# EAGLE design TSOC_USBUART2_R4_0 (EAGLE 6.6.0)
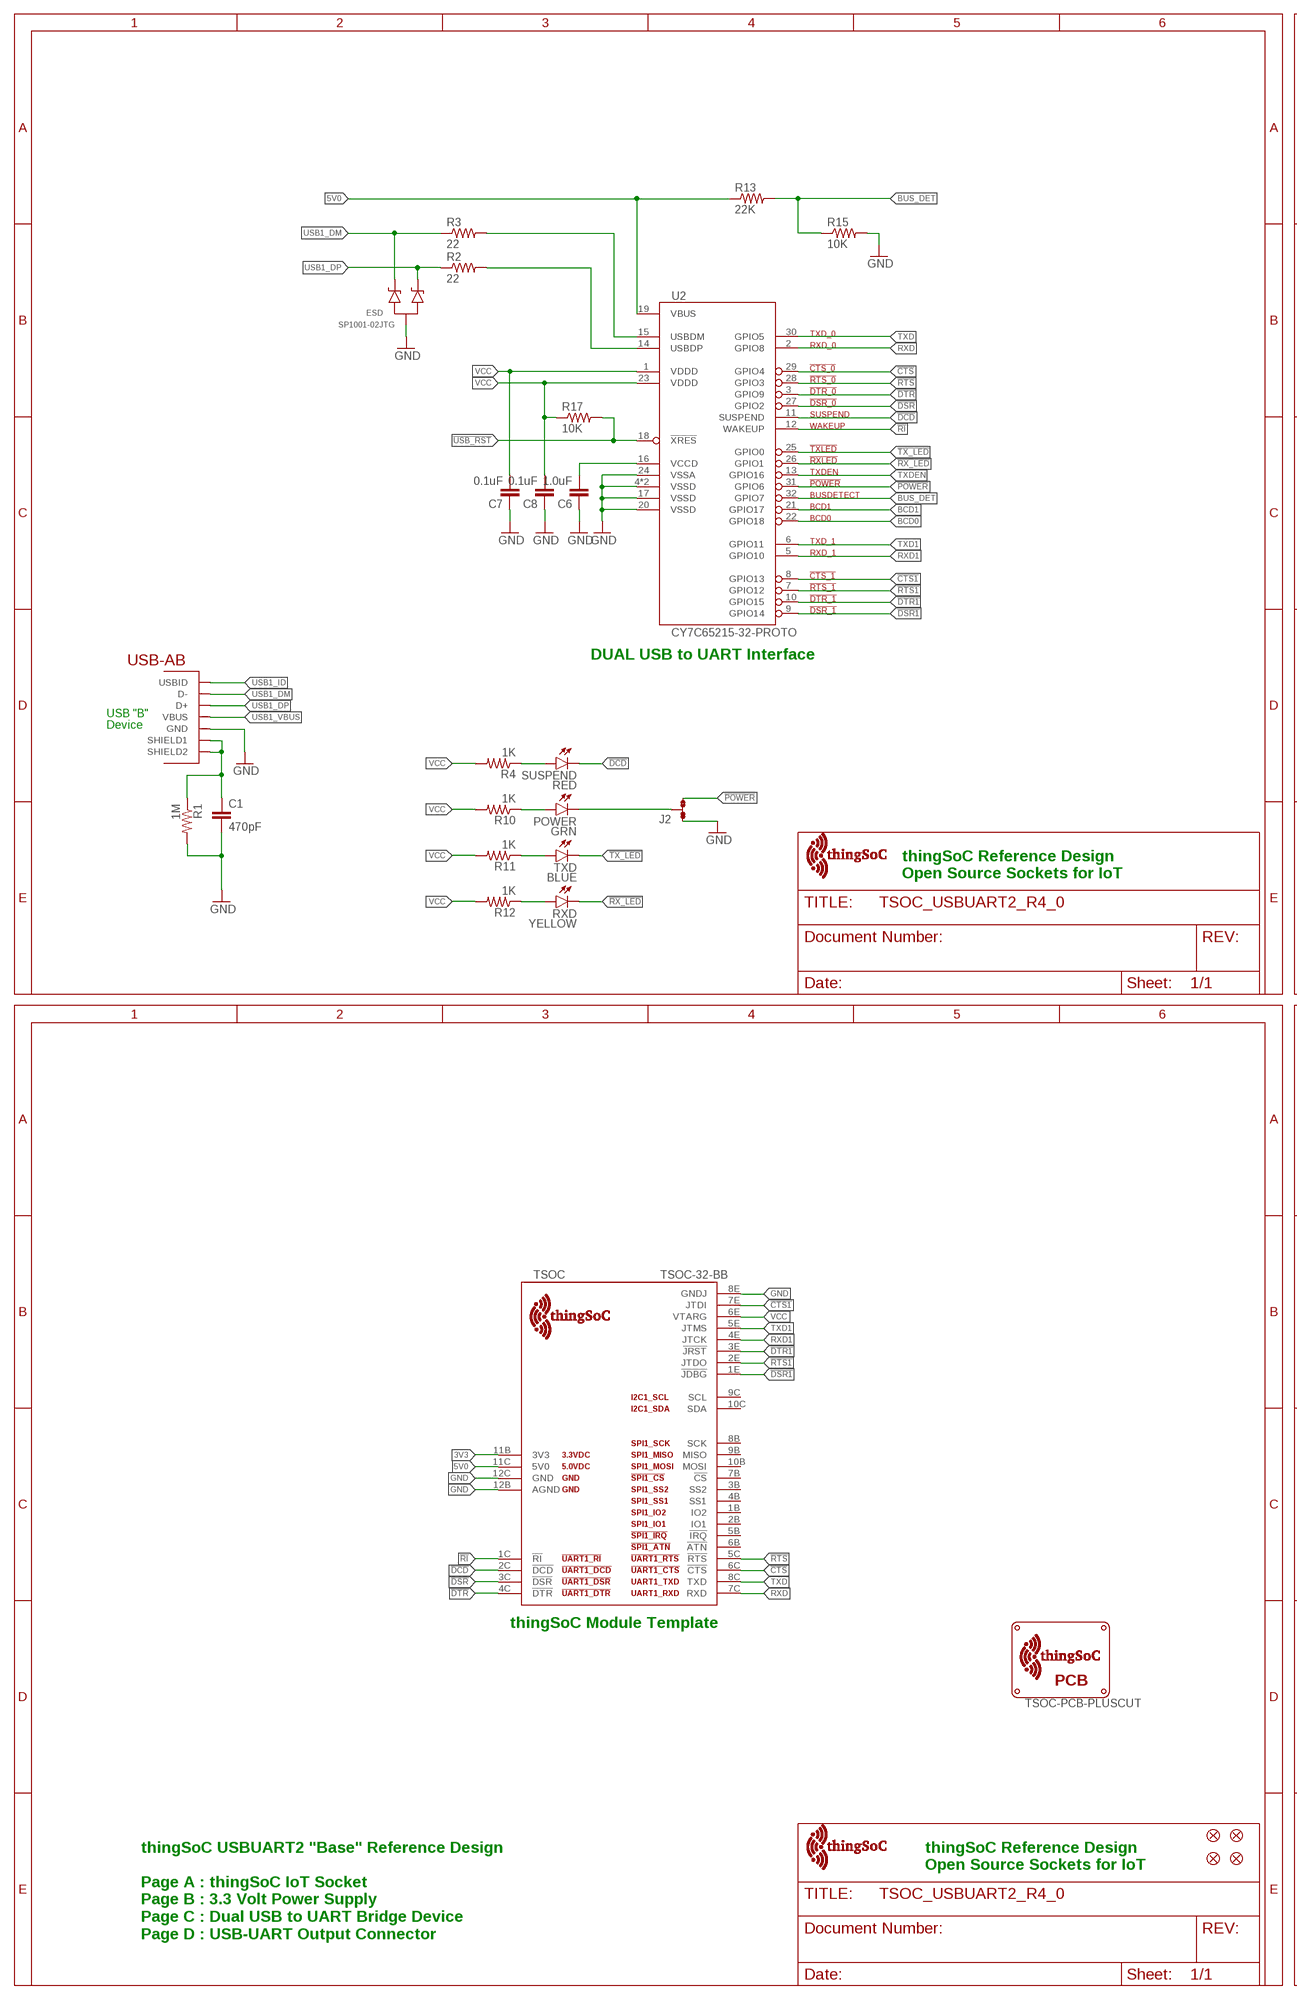
[diagram p0: schematic, sheet 1, part 1 of 2]
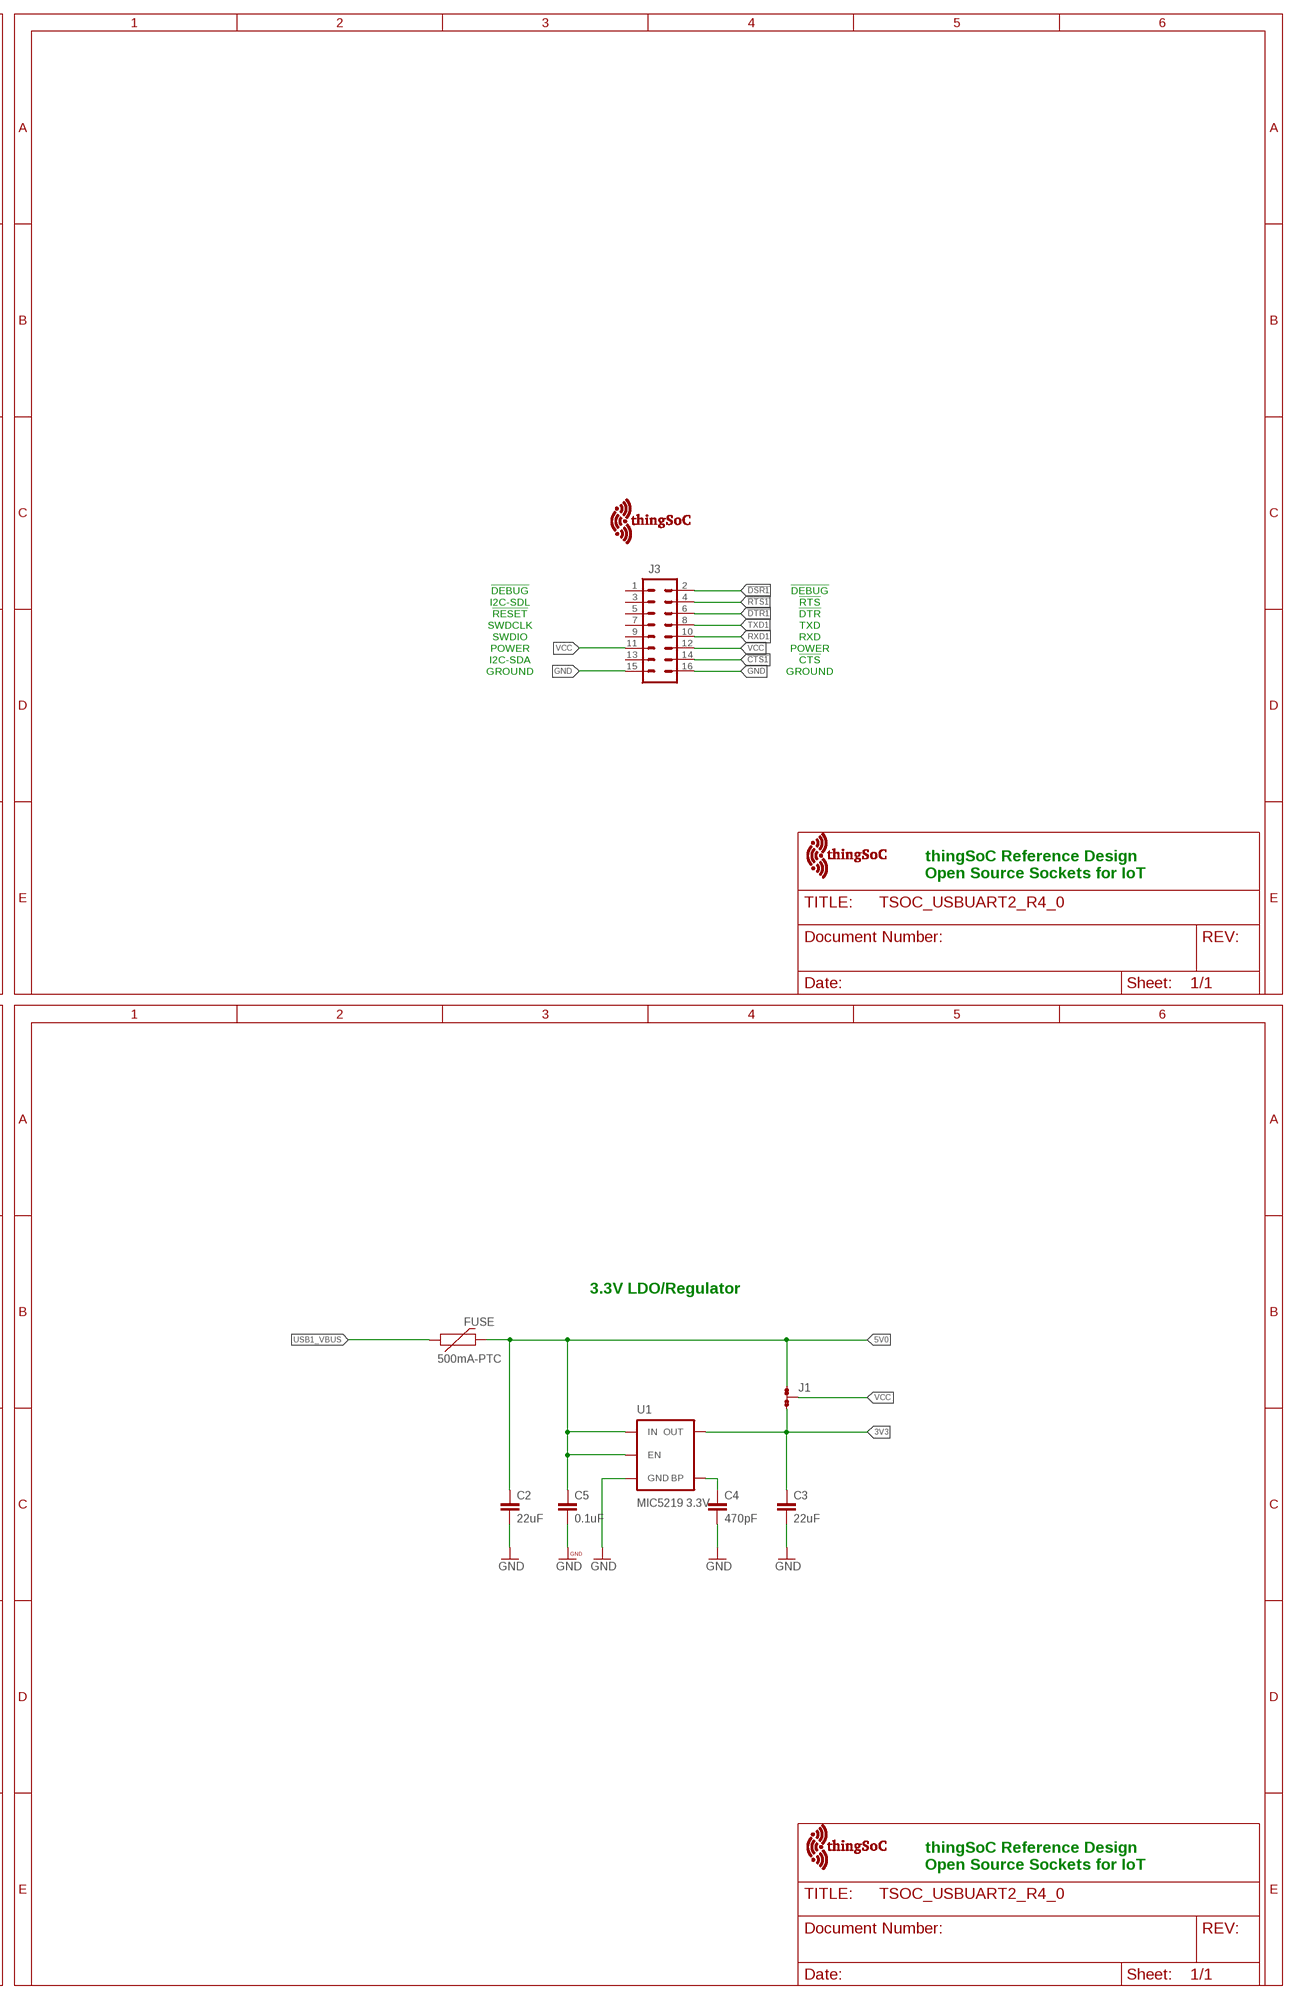
[diagram p1: schematic, sheet 1, part 2 of 2]

## Parts
C1  470pF  CAP-0603  [EIA-0603]
C2  22uF  CAP-1206  [EIA-1206]
C3  22uF  CAP-1206  [EIA-1206]
C4  470pF  CAP-0603  [EIA-0603]
C5  0.1uF  CAP-0603  [EIA-0603]
C6  1.0uF  CAP-0603  [EIA-0603]
C7  0.1uF  CAP-0603  [EIA-0603]
C8  0.1uF  CAP-0603  [EIA-0603]
ESD  SP1001-02JTG  [SC70-3]
FID1  FIDUCIALUFIDUCIAL  [MICRO-FIDUCIAL]
FID2  FIDUCIALUFIDUCIAL  [MICRO-FIDUCIAL]
FID3  FIDUCIALUFIDUCIAL  [MICRO-FIDUCIAL]
FID4  FIDUCIALUFIDUCIAL  [MICRO-FIDUCIAL]
FUSE  500mA-PTC  PTCSMD  [PTC-1206]
J1  JMP-3-1_2  [JMP-3-1_2]
J2  JMP-3-1_2  [JMP-3-1_2]
J3  M08X2  [2X8]
POWER  GRN  LED0603  [LED-0603]
R1  1M  RESISTOR-0603  [EIA-0603]
R2  22  RESISTOR-0603  [EIA-0603]
R3  22  RESISTOR-0603  [EIA-0603]
R4  1K  RESISTOR-0603  [EIA-0603]
R10  1K  RESISTOR-0603  [EIA-0603]
R11  1K  RESISTOR-0603  [EIA-0603]
R12  1K  RESISTOR-0603  [EIA-0603]
R13  22K  RESISTOR-0603  [EIA-0603]
R15  10K  RESISTOR-0603  [EIA-0603]
R17  10K  RESISTOR-0603  [EIA-0603]
RXD  YELLOW  LED0603  [LED-0603]
SUSPEND  RED  LED0603  [LED-0603]
TSOC  TSOC-32-BB  [TSOC-BB-S32]
TXD  BLUE  LED0603  [LED-0603]
U1  MIC5219 3.3V  V_REG_MIC52193.3V  [SOT23-5]
U2  CY7C65215-32-PROTO  [QFN32-PROTO]
U$3  TSOC-LOGO-LRG  [TSOC-LOGO-LRG]
U$4  TSOC-LOGO  [TSOC-LOGO-BLANK]
U$5  TSOC-LOGO  [TSOC-LOGO-BLANK]
U$6  TSOC-LOGO  [TSOC-LOGO-BLANK]
U$7  TSOC-PCB-PLUSCUT  [TSOC-BB-BRD-PLUS-CUT]
U$8  TSOC-LOGO-SMALL  [TSOC-LOGO-SML]
USB  USB_AB  [USB-AB-MICRO-SMD]

## Nets
3V3: C3.1 J1.3 TSOC.11B(3V3) U1.5(OUT)
5V0: C2.1 C5.1 FUSE.2 J1.1 R13.1 TSOC.11C(5V0) U1.1(IN) U1.3(EN) U2.19(VBUS)
!CTS: TSOC.6C(!CTS) U2.29(GPIO4)
!CTS1: J3.14 TSOC.7E(JTDI) U2.8(GPIO13)
!DCD: SUSPEND.C TSOC.2C(!DCD) U2.11(SUSPEND)
!DSR: TSOC.3C(!DSR) U2.27(GPIO2)
!DSR1: J3.2 TSOC.1E(!JDBG) U2.9(GPIO14)
!DTR: TSOC.4C(!DTR) U2.3(GPIO9)
!DTR1: J3.6 TSOC.3E(!JRST) U2.10(GPIO15)
!POWER: J2.3 U2.31(GPIO6)
!RI: TSOC.1C(!RI) U2.12(WAKEUP)
!RTS: TSOC.5C(!RTS) U2.28(GPIO3)
!RTS1: J3.4 TSOC.2E(JTDO) U2.7(GPIO12)
!RX_LED: RXD.C U2.26(GPIO1)
!TX_LED: TXD.C U2.25(GPIO0)
!USB_RST: R17.2 U2.18(!XRES)
BCD0: U2.22(GPIO18)
BCD1: U2.21(GPIO17)
BLU: R11.1 TXD.A
BUS_DET: R13.2 R15.1 U2.32(GPIO7)
BYPASS1: C4.1 U1.4(BP)
GND [vcc]: C1.2 C2.2 C3.2 C4.2 C5.2 C6.1 C7.1 C8.1 ESD.3(A) J2.1 J3.15 J3.16 R1.2 R15.2 TSOC.8E(GNDJ) TSOC.12B(AGND) TSOC.12C(GND) U1.2(GND) U2.4(VSSD) U2.17(VSSD) U2.20(VSSD) U2.24(VSSA) U2.EXP(VSSD) USB.GND
GRN: POWER.A R10.1
PWR: J2.2 POWER.C
RED: R4.1 SUSPEND.A
RXD: TSOC.7C(RXD) U2.2(GPIO8)
RXD1: J3.10 TSOC.4E(JTCK) U2.5(GPIO10)
TXD: TSOC.8C(TXD) U2.30(GPIO5)
TXD1: J3.8 TSOC.5E(JTMS) U2.6(GPIO11)
TXDEN: U2.13(GPIO16)
USB1_DM: ESD.2(C2) R3.1 USB.D-
USB1_DP: ESD.1(C1) R2.1 USB.D+
USB1_ID: USB.ID(USBID)
USB1_M: R3.2 U2.15(USBDM)
USB1_P: R2.2 U2.14(USBDP)
USB1_SHIELD: C1.1 R1.1 USB.SHIELD1 USB.SHIELD2
USB1_VBUS: FUSE.1 USB.VBUS
VCC: C7.2 C8.2 J1.2 J3.11 J3.12 R4.2 R10.2 R11.2 R12.2 R17.1 TSOC.6E(VTARG) U2.1(VDDD) U2.23(VDDD)
VCCD1: C6.2 U2.16(VCCD)
YEL: R12.1 RXD.A
Unconnected: J3.1 J3.3 J3.5 J3.7 J3.9 J3.13 TSOC.1B(IO2) TSOC.2B(IO1) TSOC.3B(SS2) TSOC.4B(SS1) TSOC.5B(!IRQ) TSOC.6B(!ATN) TSOC.7B(!CS) TSOC.8B(SCK) TSOC.9B(MISO) TSOC.9C(SCL) TSOC.10B(MOSI) TSOC.10C(SDA)

## Notes on the sheet
- !DEBUG | !DEBUG
- I2C-SDL | !RTS
- !RESET | !DTR
- SWDCLK | TXD
- SWDIO | RXD
- POWER | POWER
- DUAL USB to UART Interface | I2C-SDA | !CTS
- GROUND | GROUND
- USB "B"
- Device
- thingSoC Reference Design
  Open Source Sockets for IoT
- thingSoC Reference Design
  Open Source Sockets for IoT
- 3.3V LDO/Regulator
- thingSoC Module Template
- thingSoC Reference Design
  Open Source Sockets for IoT
- thingSoC Reference Design
  Open Source Sockets for IoT
- thingSoC USBUART2 "Base" Reference Design
  
  Page A : thingSoC IoT Socket
  Page B : 3.3 Volt Power Supply
  Page C : Dual USB to UART Bridge Device
  Page D : USB-UART Output Connector

## Library data of the parts
C1-C8 = TSOC_USBUART2:CAP: Ceramic Capacitor SMD
ESD = TSOC-ESP8266-BASE:SP1001-02JTG: Littelfuse SP1001-02JTG TVS Diode Array 8pf 15kV Source: http://www.littelfuse.com/data/en/Product_Catalogs/Littelfuse_TVS_Diode_Array_SPA_Catalog.pdf patternshed.com: created 3/25/2012
FID1-FID4 = TSOC-ESP8266-BASE:FIDUCIAL: Fiducial Alignment Points Various fiducial points for machine vision alignment.
FUSE = SparkFun:PTC: Resettable Fuse PTC Resettable Fuse. Spark Fun Electronics SKU : COM-08357
J1 J2 = PatternAgents-ProtoPads:JMP-3-1_2: Three Terminal Jumper - 1 & 2 Connected Positions 1and 2 are normally connected. PatternAgents ProtoPads Library Schematic and PCB layout libraries for design patterns by PatternAgents. For the CADSoft Eagle CAD program : http://www.cadsoftusa.com/download-eagle/ Source LBR : http://www.patternagents.com Github : https://github.com/PatternAgents License : http://creativecommons.org/licenses/by-sa/4.0/ (Creative Commons 4.0) THIS SOFTWARE IS PROVIDED BY THE CONTRIBUTORS "AS IS" AND WITHOUT ANY EXPRESS OR IMPLIED WARRANTIES, INCLUDING, BUT NOT LIMITED TO, THE IMPLIED WARRANTIES OF MERCHANTABILITY AND FITNESS FOR A PARTICULAR PURPOSE ARE DISCLAIMED. IN NO EVENT SHALL THE COPYRIGHT OWNER OR CONTRIBUTORS BE LIABLE FOR ANY DIRECT, INDIRECT, INCIDENTAL, SPECIAL, EXEMPLARY, OR CONSEQUENTIAL DAMAGES (INCLUDING, BUT NOT LIMITED TO, PROCUREMENT OF SUBSTITUTE GOODS OR SERVICES; LOSS OF USE, DATA, OR PROFITS; OR BUSINESS INTERRUPTION) HOWEVER CAUSED AND ON ANY THEORY OF LIABILITY, WHETHER IN CONTRACT, STRICT LIABILITY, OR TORT (INCLUDING NEGLIGENCE OR OTHERWISE) ARISING IN ANY WAY OUT OF THE USE OF THIS SOFTWARE, EVEN IF ADVISED OF THE POSSIBILITY OF SUCH DAMAGE.; BOM: EXCLUDE
J3 = PatternAgents-ProtoPads:M08X2: .1" headers, two rows of 8 each
POWER RXD SUSPEND TXD = TSOC-ESP8266-BASE:LED: LEDs Standard schematic elements and footprints for 5mm, 3mm, 1206, and 0603 sized LEDs. 5mm - Spark Fun Electronics SKU : COM-00529 (and others)
R1-R4 R10-R13 R15 R17 = TSOC_USBUART2:RESISTOR
TSOC = thingSoC:TSOC-32: thingSoC Thirty-Two (32) Pin Socket Source LBR : http://www.thingsoc.com Github : https://github.com/thingsoc License : http://creativecommons.org/licenses/by-sa/4.0/ (Creative Commons 4.0) THIS SOFTWARE IS PROVIDED BY THE CONTRIBUTORS "AS IS" AND WITHOUT ANY EXPRESS OR IMPLIED WARRANTIES, INCLUDING, BUT NOT LIMITED TO, THE IMPLIED WARRANTIES OF MERCHANTABILITY AND FITNESS FOR A PARTICULAR PURPOSE ARE DISCLAIMED. IN NO EVENT SHALL THE COPYRIGHT OWNER OR CONTRIBUTORS BE LIABLE FOR ANY DIRECT, INDIRECT, INCIDENTAL, SPECIAL, EXEMPLARY, OR CONSEQUENTIAL DAMAGES (INCLUDING, BUT NOT LIMITED TO, PROCUREMENT OF SUBSTITUTE GOODS OR SERVICES; LOSS OF USE, DATA, OR PROFITS; OR BUSINESS INTERRUPTION) HOWEVER CAUSED AND ON ANY THEORY OF LIABILITY, WHETHER IN CONTRACT, STRICT LIABILITY, OR TORT (INCLUDING NEGLIGENCE OR OTHERWISE) ARISING IN ANY WAY OUT OF THE USE OF THIS SOFTWARE, EVEN IF ADVISED OF THE POSSIBILITY OF SUCH DAMAGE.
U1 = TSOC-ESP8266-BASE:V_REG_MIC5219: V_REG MIC5219 Standard 3.3V and 5V 500mA LDO voltage regulator in SOT-23 layout. Micrel part MIC5219. BP (by-pass) pin is used to lower output noise with 470pF cap, may be left open.; PROD_ID: VREG-09872
U2 = PatternAgents-Cypress:CY7C65215-32: Cypress EZ-USB ® CY7C65215-32QFN DUAL CHANNEL USB TO UART/SPI/IC Bridge Full-Speed USB Peripheral Controller Source Data: http://www.cypress.com/?mpn=CY7C65211-24QFN LBR Source: http://www.patternagents.com THIS SOFTWARE IS PROVIDED BY THE CONTRIBUTORS "AS IS" AND WITHOUT ANY EXPRESS OR IMPLIED WARRANTIES, INCLUDING, BUT NOT LIMITED TO, THE IMPLIED WARRANTIES OF MERCHANTABILITY AND FITNESS FOR A PARTICULAR PURPOSE ARE DISCLAIMED. IN NO EVENT SHALL THE COPYRIGHT OWNER OR CONTRIBUTORS BE LIABLE FOR ANY DIRECT, INDIRECT, INCIDENTAL, SPECIAL, EXEMPLARY, OR CONSEQUENTIAL DAMAGES (INCLUDING, BUT NOT LIMITED TO, PROCUREMENT OF SUBSTITUTE GOODS OR SERVICES; LOSS OF USE, DATA, OR PROFITS; OR BUSINESS INTERRUPTION) HOWEVER CAUSED AND ON ANY THEORY OF LIABILITY, WHETHER IN CONTRACT, STRICT LIABILITY, OR TORT (INCLUDING NEGLIGENCE OR OTHERWISE) ARISING IN ANY WAY OUT OF THE USE OF THIS SOFTWARE, EVEN IF ADVISED OF THE POSSIBILITY OF SUCH DAMAGE.
U$3-U$6 U$8 = thingSoC:TSOC-LOGO: thingSoC Logo Source LBR : http://www.thingsoc.com Github : https://github.com/thingsoc License : http://creativecommons.org/licenses/by-sa/4.0/ (Creative Commons 4.0) THIS SOFTWARE IS PROVIDED BY THE CONTRIBUTORS "AS IS" AND WITHOUT ANY EXPRESS OR IMPLIED WARRANTIES, INCLUDING, BUT NOT LIMITED TO, THE IMPLIED WARRANTIES OF MERCHANTABILITY AND FITNESS FOR A PARTICULAR PURPOSE ARE DISCLAIMED. IN NO EVENT SHALL THE COPYRIGHT OWNER OR CONTRIBUTORS BE LIABLE FOR ANY DIRECT, INDIRECT, INCIDENTAL, SPECIAL, EXEMPLARY, OR CONSEQUENTIAL DAMAGES (INCLUDING, BUT NOT LIMITED TO, PROCUREMENT OF SUBSTITUTE GOODS OR SERVICES; LOSS OF USE, DATA, OR PROFITS; OR BUSINESS INTERRUPTION) HOWEVER CAUSED AND ON ANY THEORY OF LIABILITY, WHETHER IN CONTRACT, STRICT LIABILITY, OR TORT (INCLUDING NEGLIGENCE OR OTHERWISE) ARISING IN ANY WAY OUT OF THE USE OF THIS SOFTWARE, EVEN IF ADVISED OF THE POSSIBILITY OF SUCH DAMAGE.
U$7 = thingSoC:TSOC-PCB: thingSoC PCB Outlines Boards Outlines for Standard Sizes (in the DImension Layer) (Registration marks in the tDocu layer - make sure to turn on tDocu/bDocu) Source LBR : http://www.thingsoc.com Github : https://github.com/thingsoc License : http://creativecommons.org/licenses/by-sa/4.0/ (Creative Commons 4.0) THIS SOFTWARE IS PROVIDED BY THE CONTRIBUTORS "AS IS" AND WITHOUT ANY EXPRESS OR IMPLIED WARRANTIES, INCLUDING, BUT NOT LIMITED TO, THE IMPLIED WARRANTIES OF MERCHANTABILITY AND FITNESS FOR A PARTICULAR PURPOSE ARE DISCLAIMED. IN NO EVENT SHALL THE COPYRIGHT OWNER OR CONTRIBUTORS BE LIABLE FOR ANY DIRECT, INDIRECT, INCIDENTAL, SPECIAL, EXEMPLARY, OR CONSEQUENTIAL DAMAGES (INCLUDING, BUT NOT LIMITED TO, PROCUREMENT OF SUBSTITUTE GOODS OR SERVICES; LOSS OF USE, DATA, OR PROFITS; OR BUSINESS INTERRUPTION) HOWEVER CAUSED AND ON ANY THEORY OF LIABILITY, WHETHER IN CONTRACT, STRICT LIABILITY, OR TORT (INCLUDING NEGLIGENCE OR OTHERWISE) ARISING IN ANY WAY OUT OF THE USE OF THIS SOFTWARE, EVEN IF ADVISED OF THE POSSIBILITY OF SUCH DAMAGE.
USB = BeeSafe:USB_AB: This is a USB AB connector that is compatible with USB OTG. i.e. this connector can serve as a host or device

## Net classes
1 vcc: width 0.254 mm

## Board
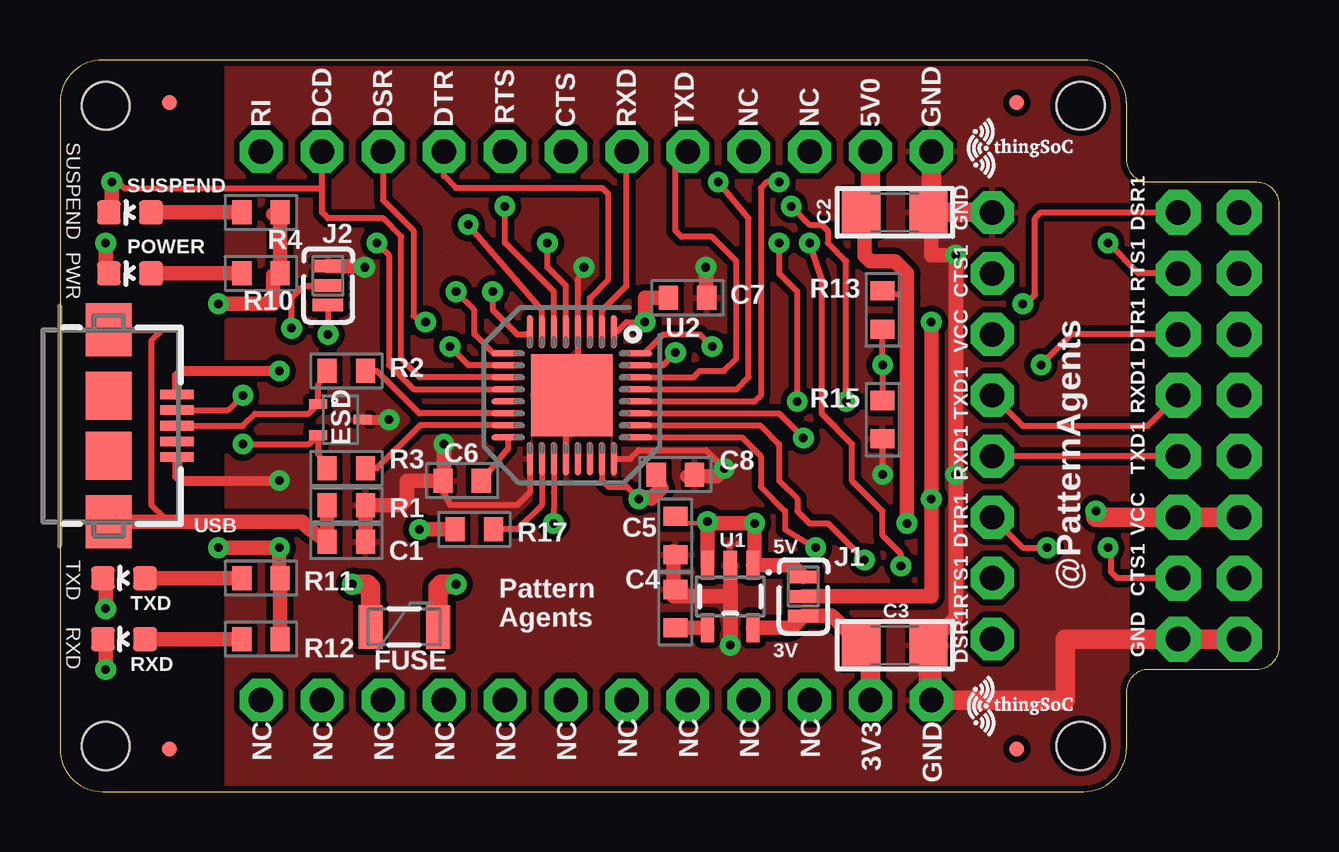
[diagram p2: board, top side]
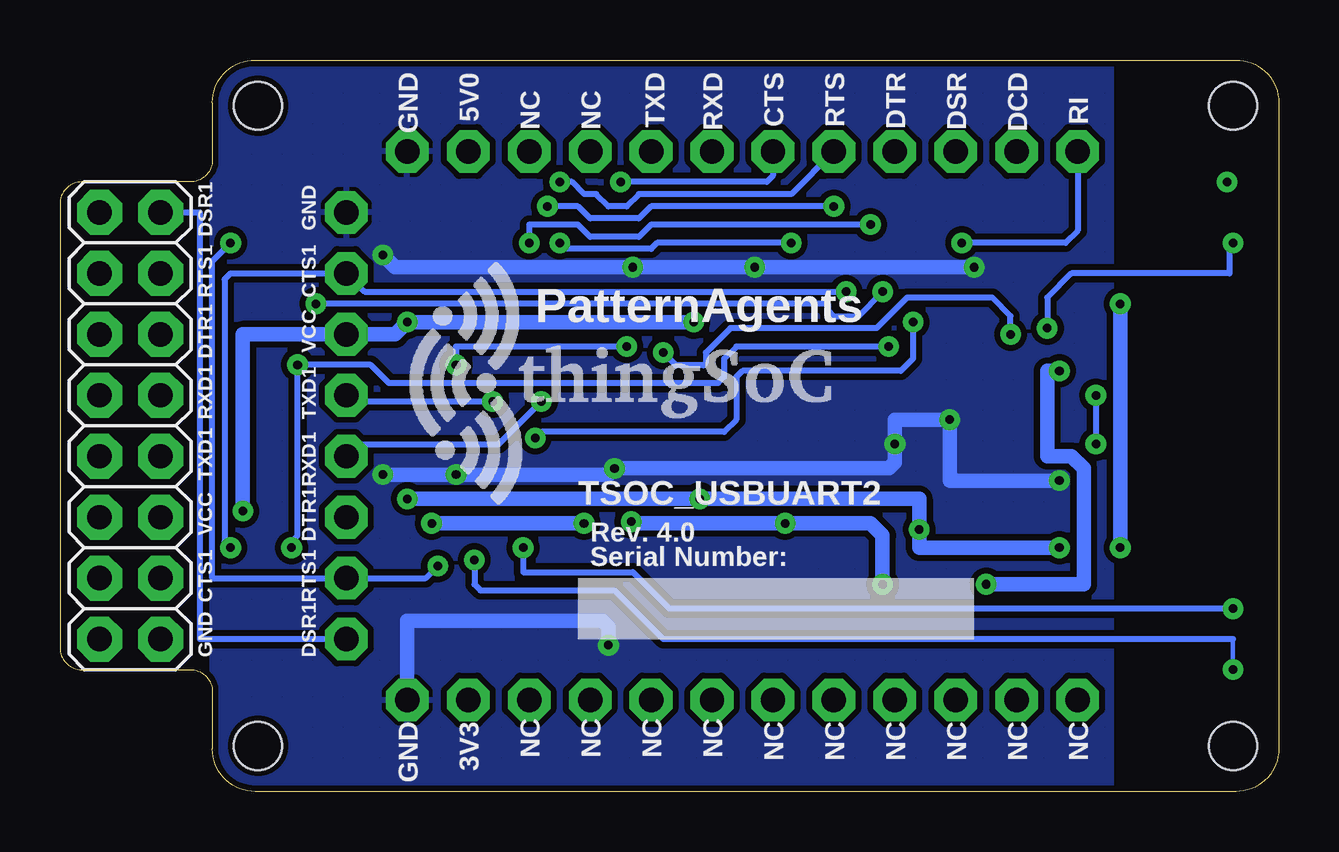
[diagram p3: board, bottom side, seen from below]

Size 50.8 x 30.48 mm. Coordinates in mm from the lower left corner, seen from the top.
Copper layers (1*16): Top 0.035mm / dielectric 1.5mm / Bottom 0.035mm
Design rules "PatternAgents_7mil": minimum track width 7mil, minimum drill 14mil, track to track 7mil, track to pad 7mil, pad to pad 7mil, via to via 7mil, smd to smd 7mil, copper to edge 7mil, drill to drill 7mil, minimum pad ring 12mil, minimum via ring 10mil, stop-mask expansion 4mil, vias tented up to drill 25mil, thermal gap 7mil

### Footprints (pad centres in the part's own frame; a part is rotated, then mirrored left to right if it is on the bottom)
EIA-0603 = smd 0.8 x 1: 1 -0.8,0; 2 0.8,0
EIA-1206 = smd 1.6 x 1.8: 1 -1.4,0; 2 1.4,0
SC70-3 = smd 0.4 x 0.75: 1 -0.65,-0.925; 2 0.65,-0.925; 3 0,0.925
MICRO-FIDUCIAL = smd 0.635 x 0.635: 1 0,0
PTC-1206 = smd 1 x 1.8: 1 -1.4,0; 2 1.4,0
JMP-3-1_2 = smd 0.508 x 1.27: 1 -0.813,0; 2 0,0; 3 0.813,0
2X8 = drill 1.016 pad 1.88 octagon: 1 0,0; 2 0,2.54; 3 2.54,0; 4 2.54,2.54; 5 5.08,0; 6 5.08,2.54; 7 7.62,0; 8 7.62,2.54; 9 10.16,0; 10 10.16,2.54; 11 12.7,0; 12 12.7,2.54; 13 15.24,0; 14 15.24,2.54; 15 17.78,0; 16 17.78,2.54
LED-0603 = smd 1 x 1: A 0,-0.877; C 0,0.877
TSOC-BB-S32 = drill 1.016 pad 1.778 octagon: 1B -11.43,-11.43; 1C -11.43,11.43; 1E 19.05,-8.89; 2B -8.89,-11.43; 2C -8.89,11.43; 2E 19.05,-6.35; 3B -6.35,-11.43; 3C -6.35,11.43; 3E 19.05,-3.81; 4B -3.81,-11.43; 4C -3.81,11.43; 4E 19.05,-1.27; 5B -1.27,-11.43; 5C -1.27,11.43; 5E 19.05,1.27; 6B 1.27,-11.43; 6C 1.27,11.43; 6E 19.05,3.81; 7B 3.81,-11.43; 7C 3.81,11.43; 7E 19.05,6.35; 8B 6.35,-11.43; 8C 6.35,11.43; 8E 19.05,8.89; 9B 8.89,-11.43; 9C 8.89,11.43; 10B 11.43,-11.43; 10C 11.43,11.43; 11B 13.97,-11.43; 11C 13.97,11.43; 12B 16.51,-11.43; 12C 16.51,11.43
SOT23-5 = smd 0.55 x 1.2: 1 -0.95,-1.3; 2 0,-1.3; 3 0.95,-1.3; 4 0.95,1.3; 5 -0.95,1.3
QFN32-PROTO = smd 1.4 x 0.254: 1 -2.65,1.75; 2 -2.65,1.25; 3 -2.65,0.75; 4 -2.65,0.25; 5 -2.65,-0.25; 6 -2.65,-0.75; 7 -2.65,-1.25; 8 -2.65,-1.75; 17 2.65,-1.75; 18 2.65,-1.25; 19 2.65,-0.75; 20 2.65,-0.25; 21 2.65,0.25; 22 2.65,0.75; 23 2.65,1.25; 24 2.65,1.75 | smd 0.254 x 1.4: 9 -1.75,-2.65; 10 -1.25,-2.65; 11 -0.75,-2.65; 12 -0.25,-2.65; 13 0.25,-2.65; 14 0.75,-2.65; 15 1.25,-2.65; 16 1.75,-2.65; 25 1.75,2.65; 26 1.25,2.65; 27 0.75,2.65; 28 0.25,2.65; 29 -0.25,2.65; 30 -0.75,2.65; 31 -1.25,2.65; 32 -1.75,2.65 | smd 3.4 x 3.4: EXP 0,0
TSOC-BB-BRD-PLUS-CUT = hole 2: 1.905,1.905; 28.575,1.905; 1.905,42.545; 28.575,42.545
USB-AB-MICRO-SMD = smd 1.4 x 0.4: D+ 2.85,0; D- 2.85,0.65; GND 2.85,-1.3; ID 2.85,-0.65; VBUS 2.85,1.3 | smd 1.9 x 2: P$6 0,1.25; P$7 0,-1.25 | smd 1.9 x 2.2: SHIELD1 0,4; SHIELD2 0,-4

### Placement (x,y rotation side)
C1  11.94,10.41 0 top
C2  34.8,24.13 0 top
C3  34.8,6.1 0 top
C4  25.65,7.62 90 top
C5  25.65,10.67 270 top
C6  16.76,12.95 0 top
C7  26.16,20.57 180 top
C8  25.65,13.21 180 top
ESD  11.68,15.49 270 top
FID1  4.57,28.7 0 top
FID2  4.57,1.78 0 top
FID3  39.88,1.78 0 top
FID4  39.88,28.7 0 top
FUSE  14.35,6.86 0 top
J1  30.99,8.13 270 top
J2  11.18,21.08 270 top
J3  49.15,24.13 270 bottom
POWER  2.92,21.59 90 top
R1  11.94,11.94 0 top
R2  11.94,17.53 0 top
R3  11.94,13.46 0 top
R4  8.38,24.13 0 top
R10  8.38,21.59 0 top
R11  8.38,8.89 0 top
R12  8.38,6.35 0 top
R13  34.29,20.07 270 top
R15  34.29,15.49 270 top
R17  17.27,10.92 0 top
RXD  2.67,6.35 90 top
SUSPEND  2.92,24.13 90 top
TSOC  19.81,15.24 0 top
TXD  2.67,8.89 90 top
U1  27.94,8.13 180 top
U2  21.34,16.51 270 top
U$1  TSOC-LOGO-SMALL  [TSOC-LOGO-SML]  38.61,3.56 0 top
U$3  33.02,17.02 0 bottom
U$4  4.57,1.78 0 top
U$5  4.57,1.78 0 top
U$6  4.57,1.78 0 top
U$7  0,30.48 270 top
U$8  38.61,26.8 0 top
USB  2.03,15.24 0 top

### Tracks (layer width: path | path; a pad name or v marks a point on that pad's centre or on a via)
3V3
  Top 0.61: U1.5 30.5,6.83 J1.3 32.18,7.32 C3.1
  Top 0.813: TSOC.11B 33.78,5.71 C3.1
5V0  (via drill 0.36)
  Top 0.178: C5.1 25.65,11.18 26.67,11.18 v26.99,11.24
  Top 0.254: R13.1 35.23,20.65 35.31,20.57 | U2.19 20.59,12.46 v20.57,11.18
  Top 0.61: J1.1 30.5,9.43 U1.1 28.96,9.49 v28.96,11.18 26.92,11.18 v26.99,11.24 | v26.99,11.24 U1.3 | v35.31,11.18 35.31,20.57 35.31,21.59 34.8,22.1 33.78,22.1 33.53,22.35 33.53,24 C2.1 33.51,24.24 33.78,24.24 | v26.98,11.25 v26.99,11.24
  Top 0.813: 33.78,24.24 TSOC.11C | FUSE.2 15.75,8.51 15.88,8.64 v16.51,8.64
  Bottom 0.61: v28.96,11.18 v35.31,11.18 | v26.99,11.24 26.92,11.18 v20.57,11.18 17.02,11.18 16.51,10.67 v16.51,8.64
!CTS  (via drill 0.36)
  Top 0.254: U2.29 28.19,16.76 28.7,17.27 28.7,23.88 v27.43,25.4
  Bottom 0.254: TSOC.6C 21.08,25.65 21.34,25.4 v27.43,25.4
!CTS1  (via drill 0.36)
  Top 0.254: v18.03,20.83 18.03,20.07 19.05,19.05 19.48,19.05 U2.8 | J3.14 44.07,8.89 43.81,9.14 43.81,10.03 v43.69,10.16
  Bottom 0.254: v43.69,10.16 43.94,10.41 43.94,21.34 43.69,21.59 TSOC.7E 38.1,20.83 v18.03,20.83
!DCD  (via drill 0.36)
  Top 0.254: v2.16,25.4 2.41,25.4 2.67,25.15 10.92,25.15 | 10.92,25.15 TSOC.2C | U2.11 15,17.26 14.22,18.03 14.22,23.11 13.46,23.88 11.18,23.88 10.92,24.13 10.92,25.15
  Top 0.61: SUSPEND.C 2.16,24.13 v2.16,25.4
!DSR  (via drill 0.36)
  Top 0.254: TSOC.3C 13.46,24.64 14.73,23.37 14.73,19.81 v15.24,19.56 | v30.99,14.73 29.96,15.76 U2.27
  Bottom 0.254: v15.24,19.56 15.24,18.03 15.75,17.53 22.35,17.53 22.61,17.27 22.61,15.49 23.11,14.99 30.73,14.99 v30.99,14.73
!DSR1  (via drill 0.36)
  Top 0.254: U2.9 18.06,18.26 17.27,19.05 17.27,20.07 v16.51,20.83 | v40.13,20.32 40.26,20.32 40.64,20.7 40.64,23.88 40.89,24.13 J3.2
  Bottom 0.254: TSOC.1E 44.96,6.35 44.96,24.13 J3.2 | v40.13,20.32 18.8,20.32 18.8,20.07 18.54,19.81 17.53,19.81 v16.51,20.83
!DTR
  Top 0.254: TSOC.4C 16,25.65 16.51,25.15 22.61,25.15 22.86,24.89 22.86,21.34 22.09,20.56 U2.3
!DTR1  (via drill 0.36)
  Top 0.254: TSOC.3E 40.13,10.16 v41.15,10.16 | U2.10 17.04,17.76 v16.26,18.54 | J3.6 42.16,19.05 v40.89,17.78
  Bottom 0.254: v41.15,10.16 41.15,10.41 40.89,10.67 v40.89,17.78 37.85,17.78 37.08,17.02 23.37,17.02 23.11,17.27 23.11,18.03 22.61,18.54 v16.26,18.54
!POWER  (via drill 0.36)
  Top 0.254: J2.3 v11.18,19.05 | U2.31 25.13,17.76 v25.65,18.29
  Bottom 0.254: v11.18,19.05 11.18,19.81 11.94,20.57 15.49,20.57 16.76,19.3 22.86,19.3 23.88,18.29 23.88,17.87 U2.31 25.13,17.76 v25.65,18.29
!RI  (via drill 0.36)
  Top 0.254: U2.12 14.73,16.76 13.72,17.78 13.72,22.35 v13.21,22.86
  Bottom 0.254: TSOC.1C 8.38,23.37 8.89,22.86 v13.21,22.86
!RTS  (via drill 0.36)
  Top 0.254: U2.28 28.95,16.26 28.96,16.26 29.21,16.51 29.21,25.15 29.46,25.4 v29.97,25.4
  Bottom 0.254: TSOC.5C 20.32,24.89 26.67,24.89 27.18,24.38 27.94,24.38 28.45,24.89 28.96,24.89 29.46,25.4 v29.97,25.4
!RTS1  (via drill 0.36)
  Top 0.254: U2.7 20.09,20.05 v17.02,23.62 | v35.05,9.4 35.05,9.91 34.29,10.67 34.29,11.68 33.02,12.95 33.02,14.48 31.75,15.75 31.75,21.34 v31.24,22.86 | J3.4 44.96,21.59 v43.69,22.86
  Bottom 0.254: v43.69,22.86 44.45,22.1 44.45,8.89 TSOC.2E 35.56,8.89 v35.05,9.4 | v17.02,23.62 26.16,23.62 26.67,23.11 28.7,23.11 29.21,23.62 31.24,23.62 v31.24,22.86
!RX_LED  (via drill 0.36)
  Top 0.254: U2.26 29.19,15.26 29.97,14.48 29.97,12.95 30.73,12.19 30.73,11.68 31.24,11.18 32,11.18 v33.53,9.65
  Top 0.61: RXD.C 1.91,6.35 v1.91,5.08
  Bottom 0.178: v1.91,5.08 1.91,6.35
  Bottom 0.254: 1.91,6.35 25.65,6.35 27.69,8.38 33.27,8.38 33.53,8.64 v33.53,9.65
!TX_LED  (via drill 0.36)
  Top 0.254: U2.25 28.42,14.76 29.21,13.97 29.21,12.7 30.23,11.68 30.23,10.92 v31.5,10.16
  Top 0.61: TXD.C 1.91,8.89 v1.91,7.62
  Bottom 0.254: v1.91,7.62 25.4,7.62 26.92,9.14 31.5,9.14 v31.5,10.16
!USB_RST
  Top 0.254: U2.18 20.09,11.96 19.05,10.92 R17.2
BLU
  Top 0.61: R11.1 TXD.A
BUS_DET  (via drill 0.36)
  Top 0.254: R13.2 v34.29,17.78 R15.1 | U2.32 24.36,18.26 25.15,19.05 26.67,19.05 v27.18,18.54
  Bottom 0.254: v27.18,18.54 34.29,18.54 v34.29,17.78
BYPASS1
  Top 0.61: U1.4 25.87,6.83 C4.1
GND  (via drill 0.36)
  Top 0.254: v21.84,21.84 21.59,21.34 U2.4 21.59,16.76 U2.EXP 21.09,16.26 U2.20 | 26.16,13.28 C8.1 | U2.24 23.77,13.86 24.13,14.22 26.92,14.22 v27.69,13.46 | R15.2 v34.29,13.21 | 16,13.03 C6.1 16,13.17 16,12.45 16.26,11.94 19.05,11.94 19.59,12.47 U2.17 | U1.2 27.86,9.53 28.04,9.53 U1.2 | 27.86,10.24 27.95,10.24 | U1.2 27.86,9.35 27.95,9.44 27.91,9.42 U1.2 | 36.27,5.51 C3.2 | C3.2 36.09,6.04 36.07,5.97 | C3.2 36.27,6.04 36.27,5.97 | 36.27,5.69 C3.2 | 36.27,5.87 C3.2 | 36.63,5.87 36.63,4.27 36.45,4.09 | 36.45,4.27 TSOC.12B | 36.45,4.27 | 36.45,4.09 TSOC.12B | 36.45,4.09 | 37.36,7.64 37.34,7.62 | 36.09,5.16 36.2,5.16 | 36.27,4.8 36.2,4.8 | 36.27,4.09 TSOC.12B | TSOC.12B 36.09,4.09 36.2,4.09 | 28.27,10.31 28.27,10.33 | U1.2 27.91,9.6 27.95,9.6 | 27.91,10.31 27.95,10.33
  Top 0.406: ESD.3 v13.72,15.49 | USB.GND 4.88,13.15 5.08,12.95 v9.14,12.95
  Top 0.61: C1.2 R1.2 14.22,11.94 14.48,12.19 14.48,12.95 C6.1 16,13.25 v16,14.48 | C8.1 26.16,13.14 27.36,13.14 v27.69,13.46 | C5.2 25.58,10.02 25.58,8.13 C4.2 25.73,8.13 27.94,8.13 | J2.1 12.65,21.89 v12.7,21.84 | U1.2 27.94,8.13 | 27.94,8.13 v27.94,6.1 | C7.1 26.92,20.57 v26.92,21.84 | C2.2 36.32,24.01 36.32,22.35 v37.34,22.35 v37.34,13.21 37.34,7.62 37.34,7.24 C3.2
  Top 0.813: TSOC.12B 41.91,3.81 41.91,6.35 J3.16 J3.15 | 36.3,3.83 TSOC.12B | TSOC.12C 36.32,24.13 TSOC.8E | C3.2 36.2,5.16 36.2,4.8 36.2,3.93 TSOC.12B
  Bottom 0.61: v37.34,13.21 v34.29,13.21 27.94,13.21 v27.69,13.46 16.26,13.46 16,13.72 v16,14.48 16,15.49 v13.72,15.49 13.72,12.95 v9.14,12.95 | v37.34,22.35 36.83,21.84 v26.92,21.84 v21.84,21.84 v12.7,21.84 | TSOC.12B 36.32,7.11 28.19,7.11 27.94,6.86 v27.94,6.1
  pour Top (isolate 0.254, hatched): 6.99,30.48 42.64,30.48 arc-90 44.45,28.67 44.45,1.81 arc-90 42.64,0 6.99,0
  pour Bottom (isolate 0.254, hatched): 6.99,30.48 42.65,30.48 arc-90 44.45,28.68 44.45,1.81 arc-90 42.64,0 6.99,0
GRN
  Top 0.61: R10.1 POWER.A
PWR  (via drill 0.36)
  Top 0.254: v9.65,19.3 9.65,20.57 10.16,21.08 J2.2
  Top 0.61: v1.91,22.86 1.91,21.73 POWER.C
  Bottom 0.254: v1.91,22.86 2.04,22.72 POWER.C 8.64,21.59 9.65,20.57 v9.65,19.3
RED
  Top 0.61: R4.1 SUSPEND.A
RXD
  Top 0.254: U2.2 22.59,20.05 23.62,21.08 TSOC.7C
RXD1  (via drill 0.36)
  Top 0.254: U2.5 21.09,21.08 20.32,21.84 v20.32,22.86 | v30.73,16.26 30.73,20.83 29.97,21.59 v29.97,22.86 | J3.10 TSOC.4E
  Bottom 0.254: TSOC.4E 38.35,14.48 32.51,14.48 v30.73,16.26 | v20.32,22.86 25.91,22.86 26.16,22.61 29.97,22.61 v29.97,22.86
TXD
  Top 0.254: U2.30 26.4,17.26 26.67,17.53 27.69,17.53 28.19,18.03 28.19,22.1 27.18,23.11 25.91,23.11 25.65,23.37 25.65,26.16 TSOC.8C
TXD1  (via drill 0.36)
  Top 0.254: TSOC.5E 40.13,15.24 45.34,15.24 J3.8 | v32.77,16.26 32.77,22.1 32,22.86 32,23.37 31.75,23.62 31.24,23.62 v30.48,24.38 | U2.6 20.59,20.82 18.54,22.86 v18.54,24.38
  Bottom 0.254: TSOC.5E 38.61,16.26 v32.77,16.26 | v18.54,24.38 26.16,24.38 26.67,23.88 28.7,23.88 29.21,24.38 v30.48,24.38
USB1_DM  (via drill 0.36)
  Top 0.254: ESD.2 10.76,14.06 R3.1 | USB.D- 7,15.89 v7.62,16.51 | 10.65,14.73 ESD.2 | v7.62,14.48 10.39,14.48 ESD.2
  Bottom 0.254: v7.62,16.51 v7.62,14.48
USB1_DP
  Top 0.254: ESD.1 10.76,16.93 R2.1 | 10.87,16.26 ESD.1 | USB.D+ 7.62,15.24 8.13,15.75 10.36,15.75 ESD.1
USB1_M
  Top 0.254: U2.15 15.01,15.26 13.21,13.46 R3.2
USB1_P
  Top 0.254: U2.14 14.97,15.76 13.21,17.53 R2.2
USB1_SHIELD
  Top 0.254: USB.SHIELD1 4.25,19.24 3.81,18.8 3.81,11.94 4.32,11.43 5.14,11.43 USB.SHIELD2
  Top 0.61: USB.SHIELD2 10.1,11.24 10.41,10.92 C1.1 R1.1
USB1_VBUS  (via drill 0.36)
  Top 0.406: USB.VBUS 4.88,17.33 5.08,17.53 v9.14,17.53
  Top 0.813: FUSE.1 12.95,8.51 12.83,8.64 v12.19,8.64
  Bottom 0.61: v12.19,8.64 8.13,8.64 8.13,13.46 8.64,13.97 9.65,13.97 9.65,17.53 v9.14,17.53
VCC  (via drill 0.36)
  Top 0.178: v24.13,12.19 24.64,12.19
  Top 0.254: U2.1 23.22,19.16 23.62,19.56 v24.38,19.56 | U2.23 22.59,12.97 22.86,12.7 23.62,12.7 v24.13,12.19
  Top 0.61: 8.89,24.06 R4.2 R10.2 8.89,21.52 8.89,20.32 v6.6,20.32 | R12.2 R11.2 9.14,8.93 v9.14,10.16 v6.6,10.16 | v36.32,19.56 v36.32,12.19 36.32,8.13 J1.2 | C8.2 25.07,12.63 24.64,12.19 | C7.2 24.38,20.57 v24.38,19.56 | R17.1 v14.99,10.92
  Top 0.813: J3.11 J3.12 43.18,11.43 v43.18,11.68
  Bottom 0.61: v43.18,11.68 43.18,19.05 TSOC.6E 36.83,19.05 v36.32,19.56 v24.38,19.56 | v36.32,12.19 v24.13,12.19 14.99,12.19 v14.99,10.92 14.99,10.16 v9.14,10.16 | v6.6,10.16 v6.6,20.32
VCCD1
  Top 0.254: U2.16 18.69,14.3 C6.2
YEL
  Top 0.61: R12.1 RXD.A

### Text on the board
tPlace: RI | DCD | DSR | DTR | RTS | CTS | RXD | TXD | NC | NC | 5V0 | GND | SUSPEND | GND | DSR1 | PWR | CTS1 | RTS1 | VCC | DTR1 | RXD1 | TXD1 | RXD1 | TXD1 | VCC | TXD | 5V | DTR1 | RTS1 | @PatternAgents | CTS1 | RXD | Pattern / Agents | 3V | GND | DSR1 | NC | NC | NC | NC | NC | NC | NC | NC | NC | NC | 3V3 | GND
bPlace: DCD | DSR | DTR | RTS | CTS | RXD | TXD | 5V0 | GND | RI | NC | NC | GND | DSR1 | CTS1 | RTS1 | PatternAgents | VCC | DTR1 | TXD1 | RXD1 | RXD1 | TXD1 | TSOC_USBUART2 | VCC | Rev. 4.0 | DTR1 | Serial Number: | RTS1 | CTS1 | DSR1 | GND | NC | NC | NC | NC | NC | NC | NC | NC | NC | NC | 3V3 | GND